# EAGLE design thermal (EAGLE 6.1)
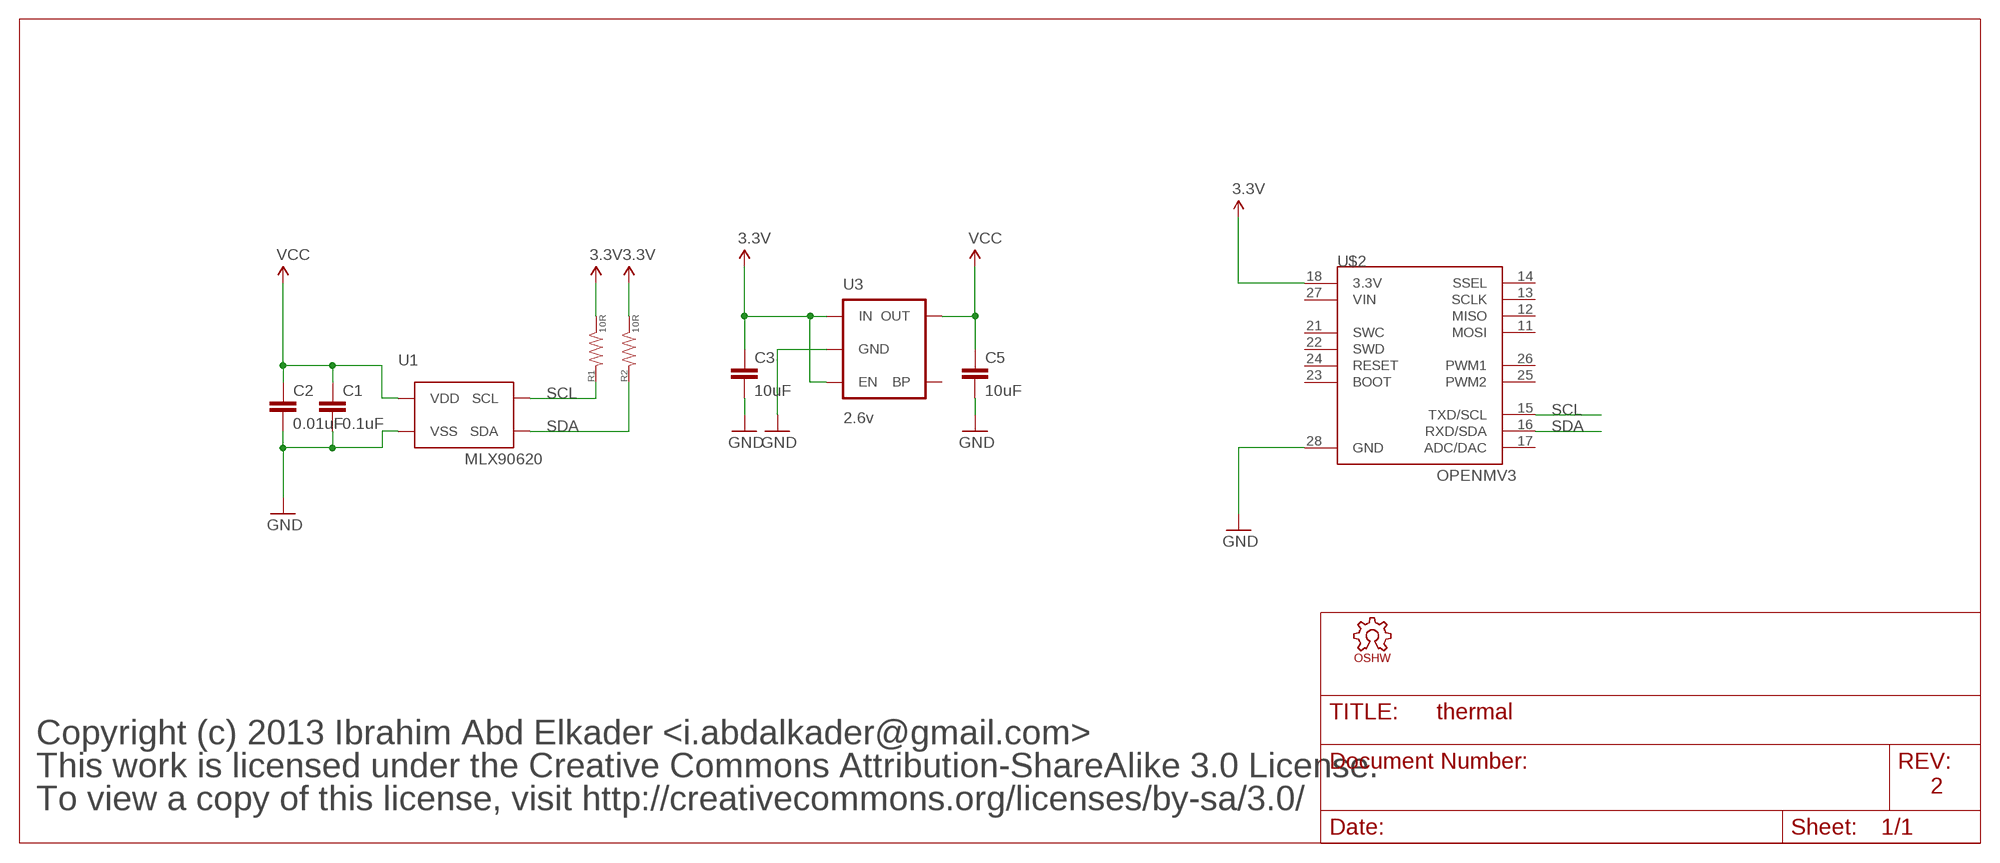
[diagram p0: schematic, sheet 1]

## Parts
C1  0.1uF  CAP0603-CAP  [0603-CAP]
C2  0.01uF  CAP0603-CAP  [0603-CAP]
C3  10uF  CAP0805  [0805]
C5  10uF  CAP0805  [0805]
LOGO1  OSHW_LOGO_8MILX0150-NT  [OSHW_8X150_NOTEXT]
R1  10R  RESISTOR0603-RES  [0603-RES]
R2  10R  RESISTOR0603-RES  [0603-RES]
U1  MLX90620  [TO39/4]
U3  2.6v  V_REG_LDOSMD  [SOT23-5]
U$2  OPENMV3  [OPENMV3]

## Nets
3.3V: C3.1 R1.1 R2.1 U3.1(IN) U3.3(EN) U$2.18(3.3V)
GND: C1.2 C2.2 C3.2 C5.2 U1.4(VSS) U3.2(GND) U$2.28(GND)
SCL: R1.2 U1.1(SCL) U$2.15(TXD/SCL)
SDA: R2.2 U1.2(SDA) U$2.16(RXD/SDA)
VCC: C1.1 C2.1 C5.1 U1.3(VDD) U3.5(OUT)
Unconnected: U3.4(BP) U$2.11(MOSI) U$2.12(MISO) U$2.13(SCLK) U$2.14(SSEL) U$2.17(ADC/DAC) U$2.21(SWC) U$2.22(SWD) U$2.23(BOOT) U$2.24(RESET) U$2.25(PWM2) U$2.26(PWM1)

## Notes on the sheet
- Copyright (c) 2013 Ibrahim Abd Elkader <i.abdalkader@gmail.com>
- This work is licensed under the Creative Commons Attribution-ShareAlike 3.0 License.
- 2
- To view a copy of this license, visit http://creativecommons.org/licenses/by-sa/3.0/

## Power pins joined to a net without a drawn wire
VIN: U$2.27(VIN)

## Library data of the parts
C1-C3 C5 = sfe:CAP: Capacitor Standard 0603 ceramic capacitor, and 0.1" leaded capacitor.
LOGO1 = iofault:OSHW_LOGO_8MIL
R1 R2 = sfe:RESISTOR: Resistor Basic schematic elements and footprints for 0603, 1206, and PTH resistors.
U1 = MLX90620:MLX90620
U3 = SparkFun:V_REG_LDO: Voltage Regulator LDO Standard 150mA LDO voltage regulator in SOT-23 layout. Micrel part MIC5205. BP (by-pass) pin is used to lower output noise with 470pF cap.
U$2 = openmv:OPENMV3

## Net classes
1 vcc: width 1.016 mm, clearance 0.203 mm
2 antenna: width 0.363 mm, clearance 0.305 mm
3 1.8v: width 0.457 mm, clearance 0.254 mm

## Board
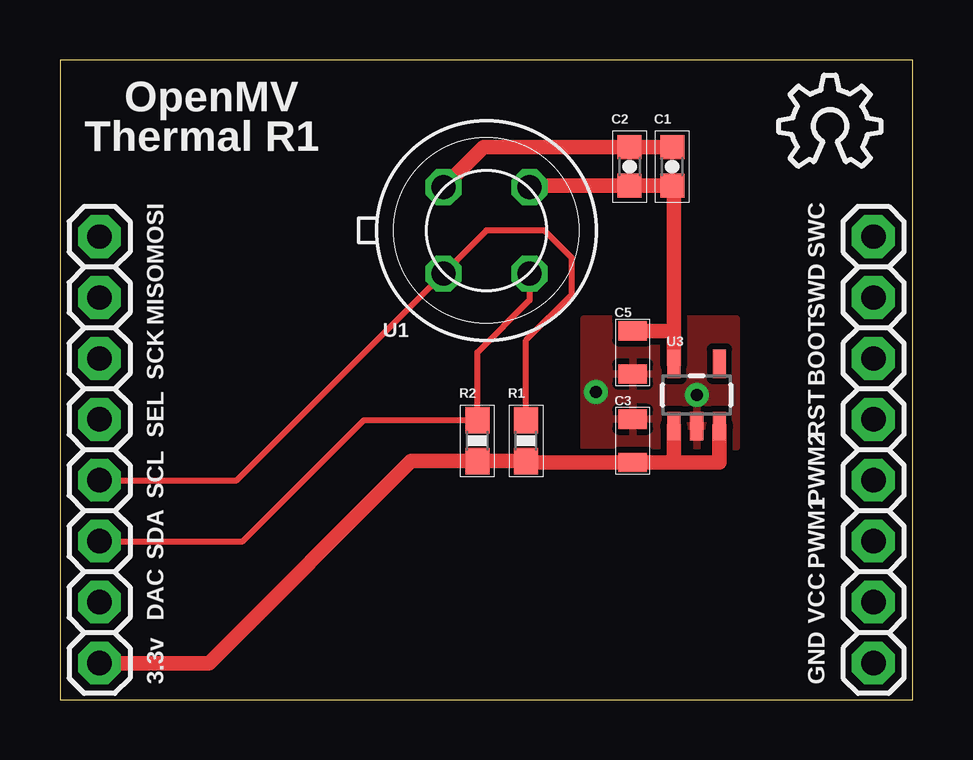
[diagram p1: board, top side]
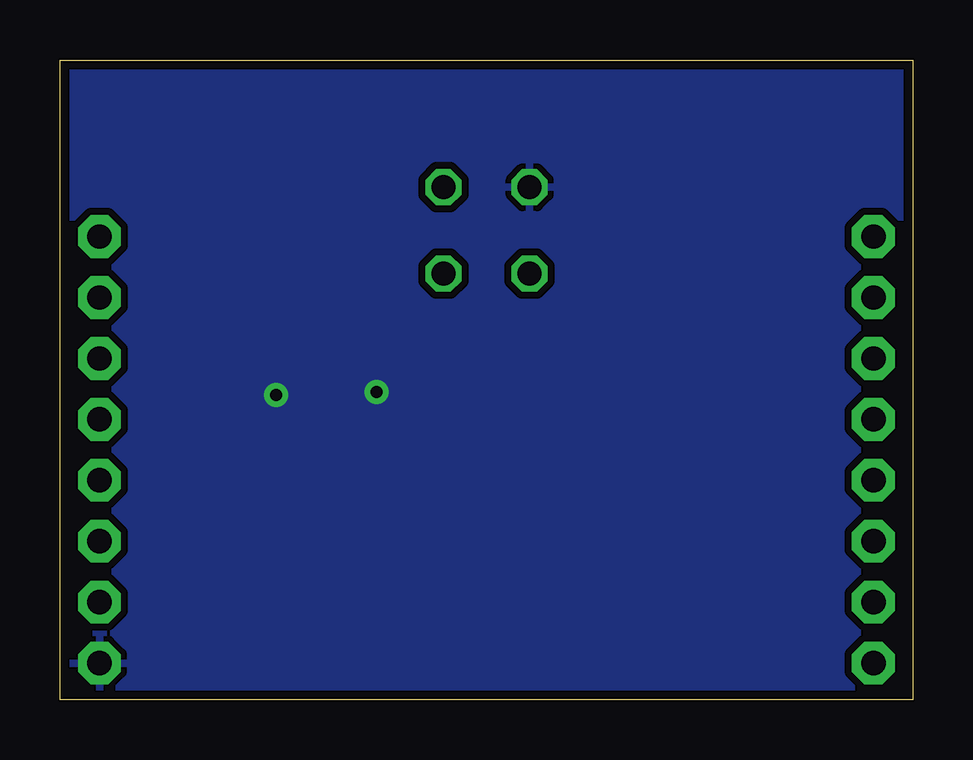
[diagram p2: board, bottom side, seen from below]

Size 35.56 x 26.67 mm. Coordinates in mm from the lower left corner, seen from the top.
Outline: 0,0 35.56,0 35.56,26.67 0,26.67 0,0
Copper layers (1*16): Top 0.0356mm / dielectric 1.5011mm / Bottom 0.0356mm
Design rules: minimum track width 6mil, minimum drill 13mil, track to track 6mil, track to pad 6mil, pad to pad 6mil, via to via 6mil, smd to smd 6mil, copper to edge 15mil, drill to drill 6mil, minimum pad ring 7mil, minimum via ring 7mil, stop-mask expansion 3mil, vias tented up to drill 30mil, thermal gap 10mil

### Footprints (pad centres in the part's own frame; a part is rotated, then mirrored left to right if it is on the bottom)
0603-CAP = smd 1 x 1: 1 -0.8,0; 2 0.8,0
0805 = smd 0.8 x 1.2: 1 -0.9,0; 2 0.9,0
0603-RES = smd 1.1 x 1: 1 -0.85,0; 2 0.85,0
TO39/4 = drill 1 octagon: 1 -1.8,-1.8; 2 1.8,-1.8; 3 1.8,1.8; 4 -1.8,1.8
SOT23-5 = smd 0.55 x 1.2: 1 -0.95,-1.3; 2 0,-1.3; 3 0.95,-1.3; 4 0.95,1.3; 5 -0.95,1.3
OPENMV3 = drill 1.016 pad 1.778 octagon: 11 1.651,19.304; 12 1.651,16.764; 13 1.651,14.224; 14 1.651,11.684; 15 1.651,9.144; 16 1.651,6.604; 17 1.651,4.064; 18 1.651,1.524; 21 33.909,19.304; 22 33.909,16.764; 23 33.909,14.224; 24 33.909,11.684; 25 33.909,9.144; 26 33.909,6.604; 27 33.909,4.064; 28 33.909,1.524

### Placement (x,y rotation side)
C1  25.53,22.23 90 top
C2  23.75,22.23 90 top
C3  23.88,10.79 90 top
C5  23.88,14.48 270 top
LOGO1  29.97,22.23 0 top
R1  19.43,10.79 90 top
R2  17.4,10.79 90 top
U1  17.78,19.56 0 top
U3  26.54,12.7 0 top
U$2  0,0 0 top

### Tracks (layer width: path | path; a pad name or v marks a point on that pad's centre or on a via)
3.3V
  Top 0.61: 25.59,9.89 C3.1 19.48,9.89 R1.1 R2.1 14.64,9.95 6.22,1.52 U$2.18 | 25.59,9.89 27.49,9.89 U3.3 | U3.1 25.59,9.89
GND  (via drill 0.5)
  Top 0.61: C1.2 C2.2 17.65,23.02 U1.4
  other vias: 26.54,12.7 22.35,12.83
  pour Bottom (isolate 0.305): 0,0 35.56,0 35.56,26.67 0,26.67
  pour Top (isolate 0.254): 28.19,10.54 21.84,10.54 21.84,15.88 28.19,15.88
SCL
  Top 0.254: U$2.15 7.37,9.14 U1.1 17.78,19.56 20.19,19.56 21.34,18.41 21.34,16.89 19.43,14.99 R1.2
SDA
  Top 0.254: U1.2 19.58,16.66 17.4,14.48 R2.2 12.66,11.64 7.62,6.6 U$2.16
VCC
  Top 0.61: U3.5 25.59,15.49 | C5.1 25.48,15.38 25.59,15.49 | U1.3 19.65,21.43 C2.1 C1.1 25.59,21.36 25.59,15.49

### Text on the board
tPlace: OpenMV | Thermal R1 | MOSI | SWC | MISO | SWD | SCK | BOOT | SEL | RST | SCL | PWM2 | SDA | PWM1 | DAC | VCC | 3.3v | GND
Document: Antenna trace 12mils (50Ohms impedance) | Stackup: | 1 oz copper | 6.7 mil prepreg | 0.5 oz copper | 47 mil core | 0.5 oz copper | 6.7 mil prepreg | 1 oz copper | er is 3.66